# EAGLE design 150110_AriloTX_REV2_3_0_868MHZ_CORRECT_TEL (EAGLE 6.5.0)
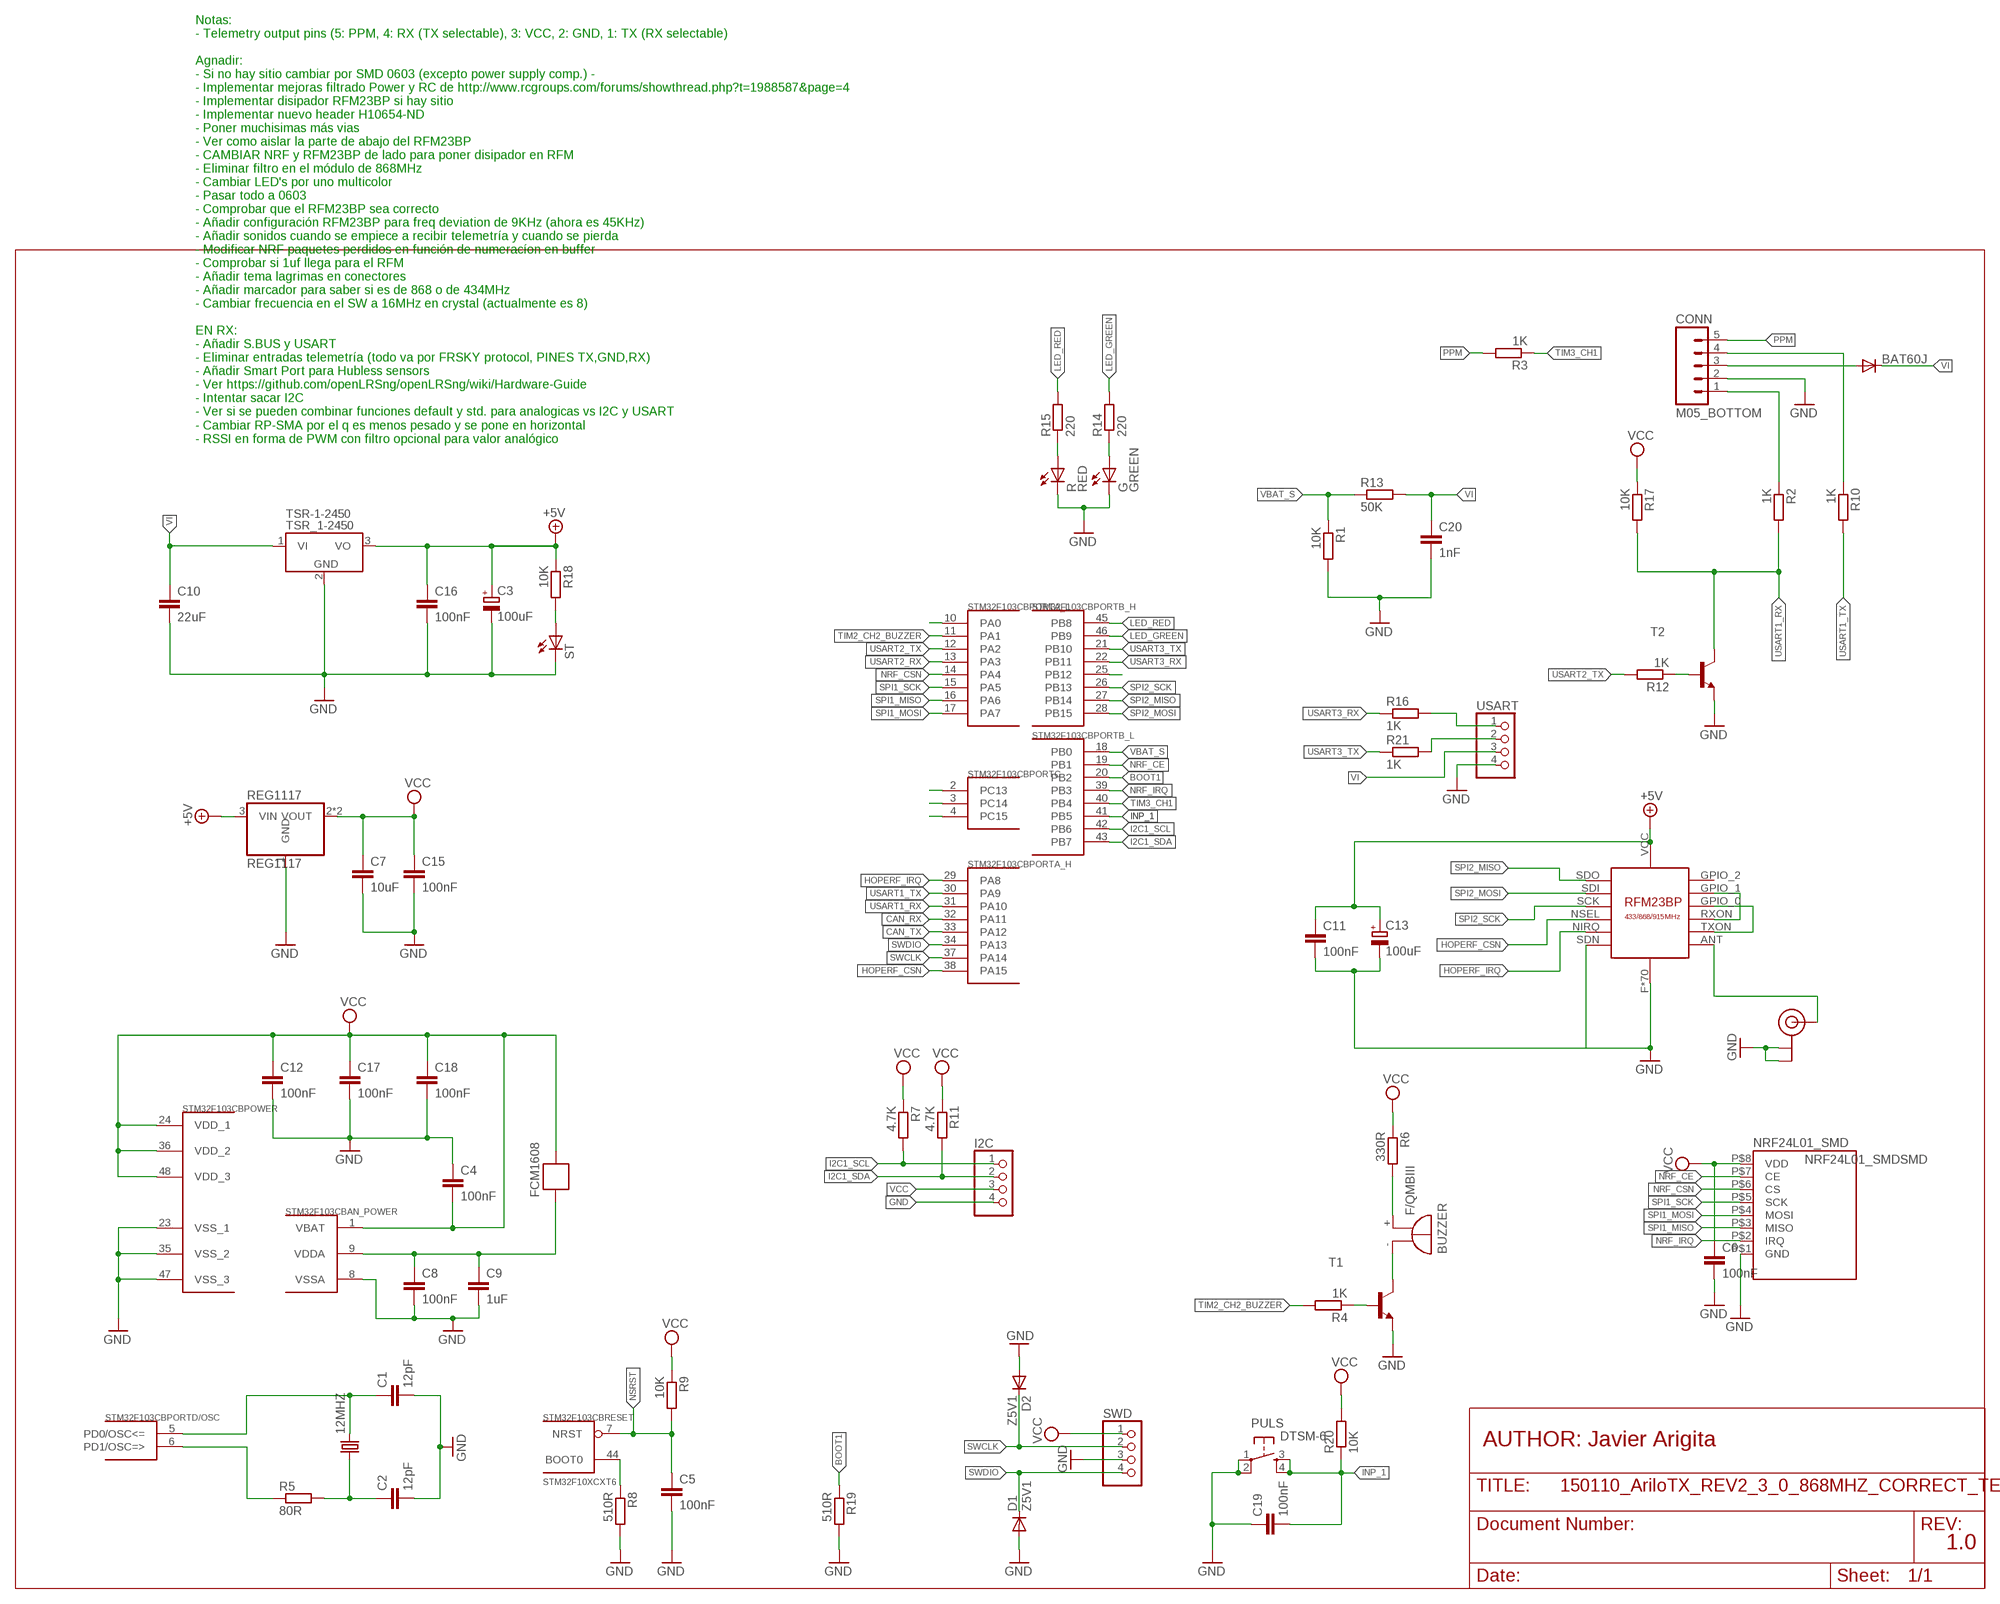
[diagram p0: schematic, sheet 1]

## Parts
12MHZ  CRYSTAL5X3  [CRYSTAL-SMD-5X3]
BAT60J  DIODE-SOD323-R  [SOD323-R]
BUZZER  F/QMBIII  [F/QMBIII]
C1  12pF  C-EUC0603  [C0603]
C2  12pF  C-EUC0603  [C0603]
C3  100uF  CPOL-EUSMCB  [SMC_B]
C4  100nF  C-EUC0603  [C0603]
C5  100nF  C-EUC0603  [C0603]
C6  100nF  C-EUC0603  [C0603]
C7  10uF  C-EUC0805  [C0805]
C8  100nF  C-EUC0603  [C0603]
C9  1uF  C-EUC0603  [C0603]
C10  22uF  C-EUC3216  [C3216]
C11  100nF  C-EUC0603  [C0603]
C12  100nF  C-EUC0603  [C0603]
C13  100uF  CPOL-EUSMCB  [SMC_B]
C15  100nF  C-EUC0603  [C0603]
C16  100nF  C-EUC0603  [C0603]
C17  100nF  C-EUC0603  [C0603]
C18  100nF  C-EUC0603  [C0603]
C19  100nF  C-EUC0603  [C0603]
C20  1nF  C-EUC0603  [C0603]
CONN  M05_BOTTOM  [M05_BOTTOM]
D1  Z5V1  DIODE-SOD323-R  [SOD323-R]
D2  Z5V1  DIODE-SOD323-R  [SOD323-R]
FCM1608  FERRITE-BEAD  [R0603]
G  GREEN  LEDCHIP-LED0603  [CHIP-LED0603]
I2C  PINHD-1X4  [1X04]
NRF24L01_SMD  NRF24L01_SMDSMD  [NRF24L01_SMD]
PULS  DTSM-6  [DTSM-6]
R  RED  LEDCHIP-LED0603  [CHIP-LED0603]
R1  10K  R-EU_R0603  [R0603]
R2  1K  R-EU_R0603  [R0603]
R3  1K  R-EU_R0603  [R0603]
R4  1K  R-EU_R0603  [R0603]
R5  80R  R-EU_R0603  [R0603]
R6  330R  R-EU_R0603  [R0603]
R7  4.7K  R-EU_R0603  [R0603]
R8  510R  R-EU_R0603  [R0603]
R9  10K  R-EU_R0603  [R0603]
R10  1K  R-EU_R0603  [R0603]
R11  4.7K  R-EU_R0603  [R0603]
R12  1K  R-EU_R0603  [R0603]
R13  50K  R-EU_R0603  [R0603]
R14  220  R-EU_R0603  [R0603]
R15  220  R-EU_R0603  [R0603]
R16  1K  R-EU_R0603  [R0603]
R17  10K  R-EU_R0603  [R0603]
R18  10K  R-EU_R0603  [R0603]
R19  510R  R-EU_R0603  [R0603]
R20  10K  R-EU_R0603  [R0603]
R21  1K  R-EU_R0603  [R0603]
REG1117  REG1117  [SOT223]
ST  LEDCHIP-LED0603  [CHIP-LED0603]
STM32F103CB  STM32F10XCXT6  [TQFP48]
SWD  PINHD-1X4  [1X04]
T1  BC848-NPN-SOT23-BEC  [SOT23-BEC]
T2  BC848-NPN-SOT23-BEC  [SOT23-BEC]
TSR-1-2450  TSR_1-2450  [TSR-1]
U$1  RFM23BP  [RFM23BP]
U.FL  U.FL  [U.FL]
USART  PINHD-1X4  [1X04]

## Nets
+5V: C3.+ C11.1 C13.+ C16.1 R18.1 REG1117.3(VIN) TSR-1-2450.3(VO) U$1.VCC
BOOT1: R19.1 STM32F103CB.20(PORTB_L:PB2)
CAN_RX: STM32F103CB.32(PORTA_H:PA11)
CAN_TX: STM32F103CB.33(PORTA_H:PA12)
GND: C1.2 C2.2 C3.- C4.1 C5.2 C6.2 C7.2 C8.2 C9.2 C10.2 C11.2 C12.2 C13.- C15.2 C16.2 C17.2 C18.2 C19.1 C20.2 CONN.2 D1.A D2.A G.C I2C.4 NRF24L01_SMD.P$1(GND) PULS.1 PULS.2 R1.2 R8.2 R19.2 R.C REG1117.1(GND) ST.C STM32F103CB.8(AN_POWER:VSSA) STM32F103CB.23(POWER:VSS_1) STM32F103CB.35(POWER:VSS_2) STM32F103CB.47(POWER:VSS_3) SWD.3 T1.E T2.E TSR-1-2450.2(GND) U$1.F1(GND) U$1.F2(GND) U$1.F3(GND) U$1.F4(GND) U$1.F5(GND) U$1.F6(GND) U$1.F7(GND) U$1.F8(GND) U$1.F9(GND) U$1.F10(GND) U$1.F11(GND) U$1.F12(GND) U$1.F13(GND) U$1.F14(GND) U$1.F15(GND) U$1.F16(GND) U$1.F17(GND) U$1.F18(GND) U$1.F19(GND) U$1.F20(GND) U$1.F21(GND) U$1.F22(GND) U$1.F23(GND) U$1.F24(GND) U$1.F25(GND) U$1.F26(GND) U$1.F27(GND) U$1.F28(GND) U$1.F29(GND) U$1.F30(GND) U$1.F31(GND) U$1.F32(GND) U$1.F33(GND) U$1.F34(GND) U$1.F35(GND) U$1.F36(GND) U$1.F37(GND) U$1.F38(GND) U$1.F39(GND) U$1.F40(GND) U$1.F41(GND) U$1.F42(GND) U$1.F43(GND) U$1.F44(GND) U$1.F45(GND) U$1.F46(GND) U$1.F47(GND) U$1.F48(GND) U$1.F49(GND) U$1.F50(GND) U$1.F51(GND) U$1.F52(GND) U$1.F53(GND) U$1.F54(GND) U$1.F55(GND) U$1.F56(GND) U$1.F57(GND) U$1.F58(GND) U$1.F59(GND) U$1.F60(GND) U$1.F61(GND) U$1.F62(GND) U$1.F63(GND) U$1.F64(GND) U$1.F65(GND) U$1.F(GND) U$1.GND1(GND) U$1.GND2(GND) U$1.GND3(GND) U$1.GND_HEAT(GND) U$1.SDN U.FL.P$1(GND) U.FL.P$2(GND) USART.4
HOPERF_CSN: STM32F103CB.38(PORTA_H:PA15) U$1.NSEL
HOPERF_IRQ: STM32F103CB.29(PORTA_H:PA8) U$1.NIRQ
I2C1_SCL: I2C.1 R7.2 STM32F103CB.42(PORTB_L:PB6)
I2C1_SDA: I2C.2 R11.2 STM32F103CB.43(PORTB_L:PB7)
INP_1: C19.2 PULS.3 PULS.4 R20.1 STM32F103CB.41(PORTB_L:PB5)
LED_GREEN: R14.2 STM32F103CB.46(PORTB_H:PB9)
LED_RED: R15.2 STM32F103CB.45(PORTB_H:PB8)
N$1: 12MHZ.3 C1.1 STM32F103CB.5(PORTD/OSC:PD0/OSC<=)
N$2: R5.1 STM32F103CB.6(PORTD/OSC:PD1/OSC=>)
N$3: 12MHZ.1 C2.1 R5.2
N$4: R8.1 STM32F103CB.44(RESET:BOOT0)
N$5: R12.1 T2.B
N$6: CONN.1 R2.1
N$7: R15.1 R.A
N$8: G.A R14.1
N$9: CONN.4 R10.1
N$10: R18.2 ST.A
N$11: U$1.ANT U.FL.P$3(SIGNAL)
N$12: R16.2 USART.1
N$13: R21.2 USART.2
N$14: BAT60J.A CONN.3
N$15: STM32F103CB.2(PORTC:PC13)
N$16: BUZZER.+(-) R6.2
N$17: C8.1 C9.1 FCM1608.2 STM32F103CB.9(AN_POWER:VDDA)
N$18: STM32F103CB.3(PORTC:PC14)
N$19: STM32F103CB.4(PORTC:PC15)
N$21: R4.1 T1.B
N$22: STM32F103CB.25(PORTB_H:PB12)
N$23: BUZZER.-(+) T1.C
N$24: STM32F103CB.10(PORTA_L:PA0)
N$25: U$1.GPIO_1 U$1.RXON
N$26: U$1.GPIO_0 U$1.TXON
NRF_CE: NRF24L01_SMD.P$7(CE) STM32F103CB.19(PORTB_L:PB1)
NRF_CSN: NRF24L01_SMD.P$6(CS) STM32F103CB.14(PORTA_L:PA4)
NRF_IRQ: NRF24L01_SMD.P$2(IRQ) STM32F103CB.39(PORTB_L:PB3)
NSRST: C5.1 R9.2 STM32F103CB.7(RESET:NRST)
PPM: CONN.5 R3.2
SPI1_MISO: NRF24L01_SMD.P$3(MISO) STM32F103CB.16(PORTA_L:PA6)
SPI1_MOSI: NRF24L01_SMD.P$4(MOSI) STM32F103CB.17(PORTA_L:PA7)
SPI1_SCK: NRF24L01_SMD.P$5(SCK) STM32F103CB.15(PORTA_L:PA5)
SPI2_MISO: STM32F103CB.27(PORTB_H:PB14) U$1.SDO
SPI2_MOSI: STM32F103CB.28(PORTB_H:PB15) U$1.SDI
SPI2_SCK: STM32F103CB.26(PORTB_H:PB13) U$1.SCK
SWCLK: D2.C STM32F103CB.37(PORTA_H:PA14) SWD.2
SWDIO: D1.C STM32F103CB.34(PORTA_H:PA13) SWD.4
TIM2_CH2_BUZZER: R4.2 STM32F103CB.11(PORTA_L:PA1)
TIM3_CH1: R3.1 STM32F103CB.40(PORTB_L:PB4)
USART1_RX: R2.2 R17.2 STM32F103CB.31(PORTA_H:PA10) T2.C
USART1_TX: R10.2 STM32F103CB.30(PORTA_H:PA9)
USART2_RX: STM32F103CB.13(PORTA_L:PA3)
USART2_TX: R12.2 STM32F103CB.12(PORTA_L:PA2)
USART3_RX: R16.1 STM32F103CB.22(PORTB_H:PB11)
USART3_TX: R21.1 STM32F103CB.21(PORTB_H:PB10)
VBAT_S: R1.1 R13.1 STM32F103CB.18(PORTB_L:PB0)
VCC: C4.2 C6.1 C7.1 C12.1 C15.1 C17.1 C18.1 FCM1608.1 I2C.3 NRF24L01_SMD.P$8(VDD) R6.1 R7.1 R9.1 R11.1 R17.1 R20.2 REG1117.2(VOUT) REG1117.4(VOUT) STM32F103CB.1(AN_POWER:VBAT) STM32F103CB.24(POWER:VDD_1) STM32F103CB.36(POWER:VDD_2) STM32F103CB.48(POWER:VDD_3) SWD.1
VI: BAT60J.C C10.1 C20.1 R13.2 TSR-1-2450.1(VI) USART.3
Unconnected: U$1.GPIO_2

## Notes on the sheet
- Notas: 
  - Telemetry output pins (5: PPM, 4: RX (TX selectable), 3: VCC, 2: GND, 1: TX (RX selectable)
  
  Agnadir: 
  - Si no hay sitio cambiar por SMD 0603 (excepto power supply comp.) - 
  - Implementar mejoras filtrado Power y RC de http://www.rcgroups.com/forums/showthread.php?t=1988587&page=4 
  - Implementar disipador RFM23BP si hay sitio
  - Implementar nuevo header H10654-ND
  - Poner muchisimas más vias
  - Ver como aislar la parte de abajo del RFM23BP
  - CAMBIAR NRF y RFM23BP de lado para poner disipador en RFM
  - Eliminar filtro en el módulo de 868MHz
  - Cambiar LED's por uno multicolor
  - Pasar todo a 0603
  - Comprobar que el RFM23BP sea correcto
  - Añadir configuración RFM23BP para freq deviation de 9KHz (ahora es 45KHz)
  - Añadir sonidos cuando se empiece a recibir telemetría y cuando se pierda
  - Modificar NRF paquetes perdidos en función de numeracíon en buffer
  - Comprobar si 1uf llega para el RFM
  - Añadir tema lagrimas en conectores
  - Añadir marcador para saber si es de 868 o de 434MHz
  - Cambiar frecuencia en el SW a 16MHz en crystal (actualmente es 8)
  
  EN RX:
  - Añadir S.BUS y USART
  - Eliminar entradas telemetría (todo va por FRSKY protocol, PINES TX,GND,RX)
  - Añadir Smart Port para Hubless sensors
  - Ver https://github.com/openLRSng/openLRSng/wiki/Hardware-Guide
  - Intentar sacar I2C
  - Ver si se pueden combinar funciones default y std. para analogicas vs I2C y USART
  - Cambiar RP-SMA por el q es menos pesado y se pone en horizontal
  - RSSI en forma de PWM con filtro opcional para valor analógico
- AUTHOR: Javier Arigita
- 1.0

## Library data of the parts
12MHZ = SparkFun-FreqCtrl:CRYSTAL: Various standard crystals. Proven footprints. Spark Fun Electronics SKU : COM-00534
BAT60J D1 D2 = diode:DIODE-: DIODE
BUZZER = buzzer:F/QMBIII: BUZZER Source: Buerklin; OC_FARNELL: unknown; OC_NEWARK: unknown
C1 C2 C4-C9 C11 C12 C15-C20 = rcl:C-EU: CAPACITOR, European symbol
C3 C13 = rcl:CPOL-EU: POLARIZED CAPACITOR, European symbol
C10 = resistor:C-EU: CAPACITOR, European symbol
CONN = RFM23BP_new:M05_BOTTOM
FCM1608 = BaseApp:FERRITE-BEAD
G R ST = led:LED: LED OSRAM: - CHIPLED LG R971, LG N971, LY N971, LG Q971, LY Q971, LO R971, LY R971 LH N974, LH R974 LS Q976, LO Q976, LY Q976 LO Q996 - Hyper CHIPLED LW Q18S LB Q993, LB Q99A, LB R99A - SideLED LS A670, LO A670, LY A670, LG A670, LP A670 LB A673, LV A673, LT A673, LW A673 LH A674 LY A675 LS A676, LA A676, LO A676, LY A676, LW A676 LS A679, LY A679, LG A679 - Hyper Micro SIDELED® LS Y876, LA Y876, LO Y876, LY Y876 LT Y87S - SmartLED LW L88C, LW L88S LB L89C, LB L89S, LG L890 LS L89K, LO L89K, LY L89K LS L896, LA L896, LO L896, LY L896 - TOPLED LS T670, LO T670, LY T670, LG T670, LP T670 LSG T670, LSP T670, LSY T670, LOP T670, LYG T670 LG T671, LOG T671, LSG T671 LB T673, LV T673, LT T673, LW T673 LH T674 LS T676, LA T676, LO T676, LY T676, LB T676, LH T676, LSB T676, LW T676 LB T67C, LV T67C, LT T67C, LS T67K, LO T67K, LY T67K, LW E67C LS E67B, LA E67B, LO E67B, LY E67B, LB E67C, LV E67C, LT E67C LW T67C LS T679, LY T679, LG T679 LS T770, LO T770, LY T770, LG T770, LP T770 LB T773, LV T773, LT T773, LW T773 LH T774 LS E675, LA E675, LY E675, LS T675 LS T776, LA T776, LO T776, LY T776, LB T776 LHGB T686 LT T68C, LB T68C - Hyper Mini TOPLED® LB M676 - Mini TOPLED Santana® LG M470 LS M47K, LO M47K, LY M47K Source: http://www.osram.convergy.de LUXEON: - LUMILED® LXK2-PW12-R00, LXK2-PW12-S00, LXK2-PW14-U00, LXK2-PW14-V00 LXK2-PM12-R00, LXK2-PM12-S00, LXK2-PM14-U00 LXK2-PE12-Q00, LXK2-PE12-R00, LXK2-PE12-S00, LXK2-PE14-T00, LXK2-PE14-U00 LXK2-PB12-K00, LXK2-PB12-L00, LXK2-PB12-M00, LXK2-PB14-N00, LXK2-PB14-P00, LXK2-PB14-Q00 LXK2-PR12-L00, LXK2-PR12-M00, LXK2-PR14-Q00, LXK2-PR14-R00 LXK2-PD12-Q00, LXK2-PD12-R00, LXK2-PD12-S00 LXK2-PH12-R00, LXK2-PH12-S00 LXK2-PL12-P00, LXK2-PL12-Q00, LXK2-PL12-R00 Source: www.luxeon.com KINGBRIGHT: KA-3528ASYC Source: www.kingbright.com
I2C SWD USART = pinhead:PINHD-1X4: PIN HEADER
NRF24L01_SMD = NRF24L01+:NRF24L01_SMD
PULS = switch-tact:DTSM-6
R1-R21 = rcl:R-EU_: RESISTOR, European symbol
REG1117 = CEDT:REG1117: 800mA and 1A Low Dropout (LDO) Positive Regulator 1.8V, 2.5V, 2.85V, 3.3V, 5V, and Adj
STM32F103CB = stm32:STM32F10XCXT6: ST STM32F101/103 48pin LQFP
T1 T2 = transistor:*-NPN-: NPN Transistror BF959 corrected 2008.03.06
TSR-1-2450 = _hhn_traco_tsr-1:TSR_1-*: TRACO TSR-1 Series Point-of-Load DC/DC-Converters Vi max. 36 V; Vo = (1.2 .. 15)V ±2%; Io = 0 .. 1 A SIP-Package (drop-in replacement for 78xx linear voltage regulators in TO220-package, vertically assembled) Source: www.tracopower.com Technologies: TSR 1- Vi (V) Vo (V) ±2% Io = 0 .. 1 A 24_ ( generic ) 2412 4.6 .. 36 1.2 2415 4.6 .. 36 1.5 2418 4.6 .. 36 1.8 2425 4.6 .. 36 2.5 2433 4.75.. 36 3.3 2450 6.5 .. 36 5.0 2465 9.0 .. 36 6.5 2490 12 .. 36 9.0 24120 15 .. 36 12 24150 18 .. 36 15 Author: Dipl.-Ing. FH Rainer Bayer HHN Hochschule Heilbronn, rainer.bayer@hs-heilbronn.de Ingenieurbüro ing-rb, mail@ing-rb.de
U$1 = RFM23BP:RFM23BP: HopeRF RFM23BP Library by: http://projects.weber-itam.de
U.FL = SparkFun-Connectors:U.FL: SMD antenna connector- WRL-09144

## Board
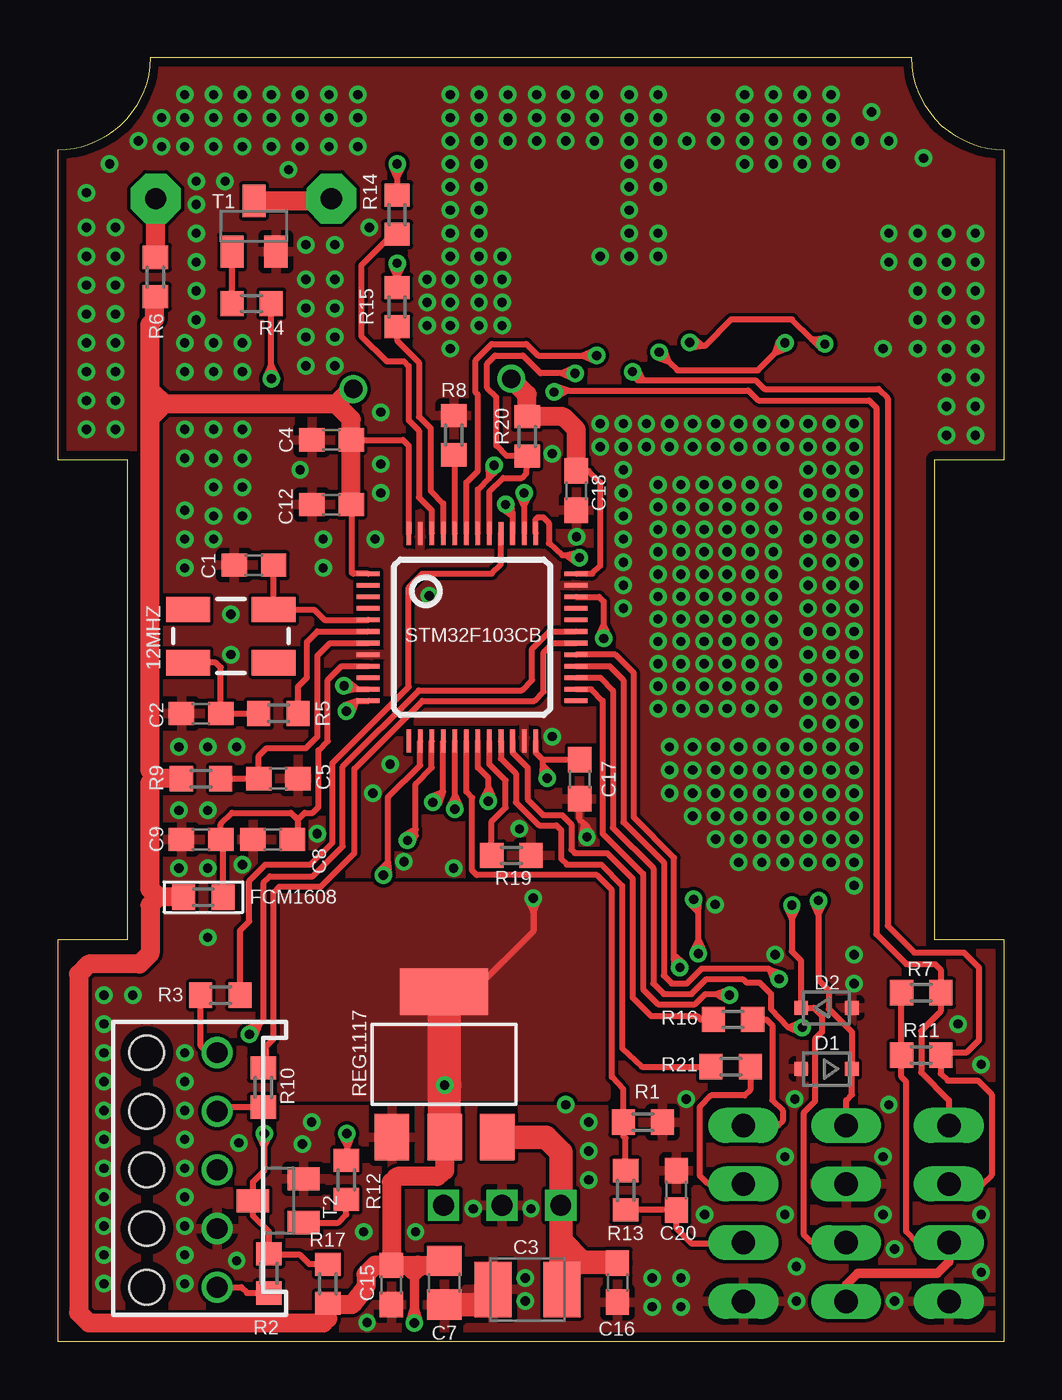
[diagram p1: board, top side]
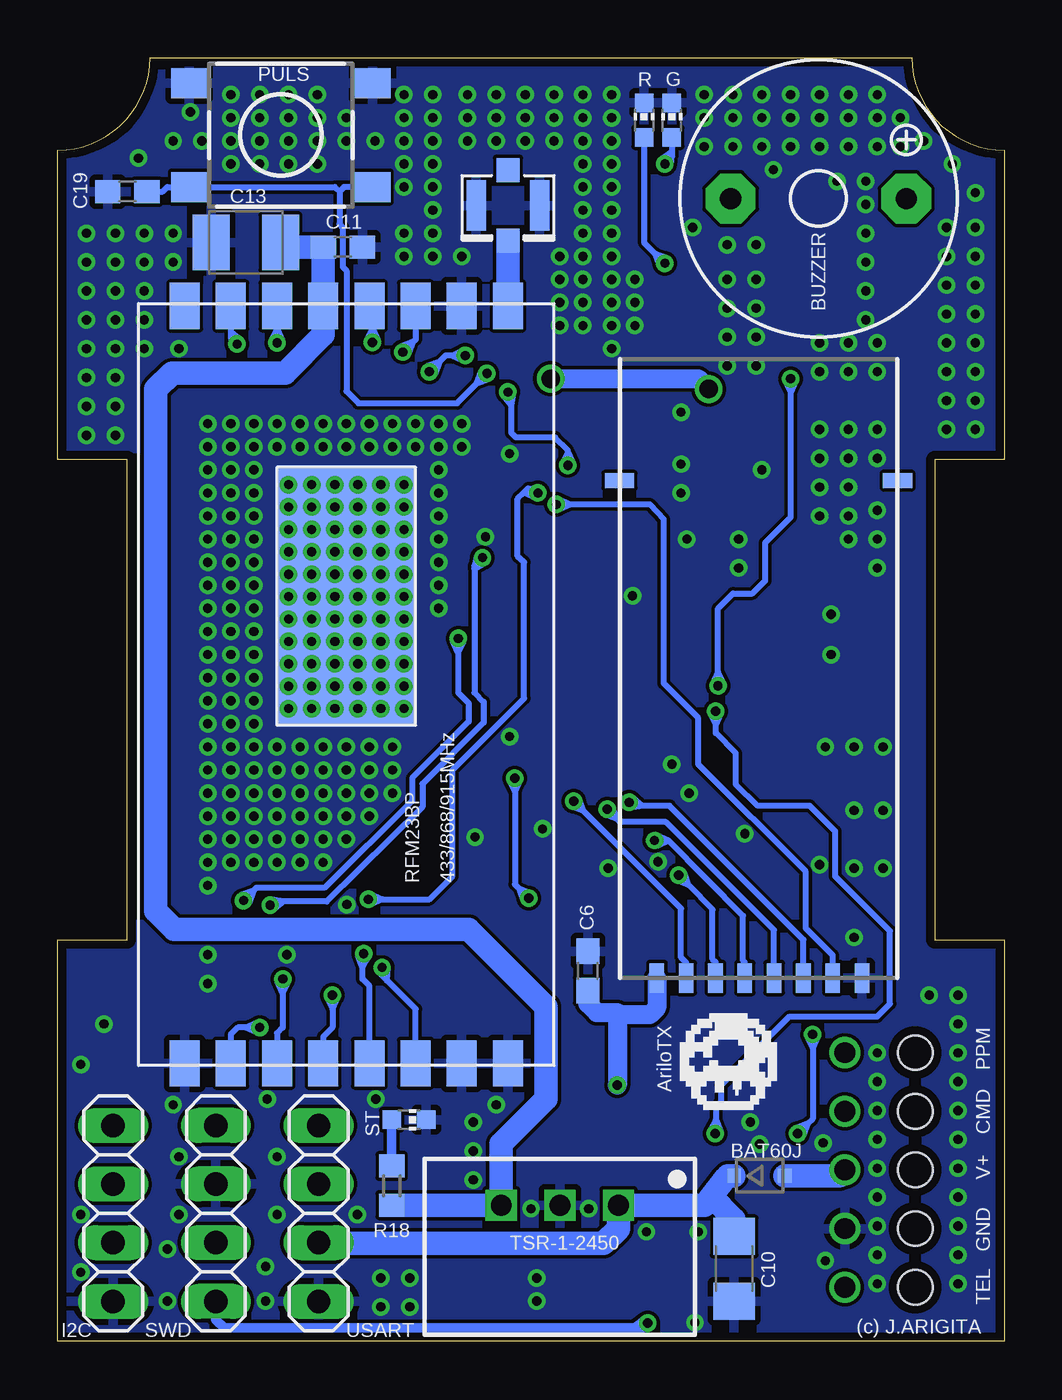
[diagram p2: board, bottom side, seen from below]

Size 41 x 55.6 mm. Coordinates in mm from the lower left corner, seen from the top.
Outline: 0,0 41,0 41,17.4 38,17.4 38,38.2 41,38.2 41,51.6 arc-90 37,55.6 4,55.6 arc-90 0,51.6 0,38.2 3,38.2 3,17.4 0,17.4 0,0
Copper layers (1*16): Top 0.0356mm / dielectric 1.5011mm / Bottom 0.0356mm
Design rules "LaenPCBOrder": minimum track width 6mil, minimum drill 13mil, track to track 6mil, track to pad 6mil, pad to pad 6mil, via to via 6mil, smd to smd 6mil, copper to edge 15mil, drill to drill 6mil, minimum pad ring 7mil, minimum via ring 7mil, stop-mask expansion 4mil, vias tented up to drill 0mil, thermal gap 10mil

### Footprints (pad centres in the part's own frame; a part is rotated, then mirrored left to right if it is on the bottom)
CRYSTAL-SMD-5X3 = smd 1.9 x 1.1: 1 -1.85,-1.15; 2 1.85,-1.15; 3 1.85,1.15; 4 -1.85,1.15
SOD323-R = smd 0.6 x 0.6: A 1.1,0; C -1.1,0
F/QMBIII = drill 0.914 pad 2.159 octagon: + 3.8,0; - -3.8,0
C0603 = smd 1.1 x 1: 1 -0.85,0; 2 0.85,0
SMC_B = smd 1.6 x 2.4: + -1.5,0; - 1.5,0
C0805 = smd 1.3 x 1.5: 1 -0.95,0; 2 0.95,0
C3216 = smd 1.6 x 1.8: 1 -1.4,0; 2 1.4,0
M05_BOTTOM = drill 0.9: 1 -5.1,-1.5; 2 -2.56,-1.5; 3 -0.02,-1.5; 4 2.52,-1.5; 5 5.06,-1.5 | hole 1.5: -5.1,1.54; -2.56,1.54; -0.02,1.54; 2.52,1.54; 5.06,1.54
R0603 = smd 1 x 1.1: 1 -0.85,0; 2 0.85,0
CHIP-LED0603 = smd 0.8 x 0.8: A 0,-0.75; C 0,0.75
1X04 = drill 1.016 long: 1 -3.81,0; 2 -1.27,0; 3 1.27,0; 4 3.81,0
NRF24L01_SMD = smd 1.27 x 0.635: P$1 26.807,10.492; P$2 26.807,9.222; P$3 26.807,7.952; P$4 26.807,6.682; P$5 26.807,5.412; P$6 26.807,4.142; P$7 26.807,2.872; P$8 26.807,1.602 | smd 0.635 x 1.27: P$11 5.267,-0.018; P$13 5.267,12.032
DTSM-6 = smd 1.55 x 1.3: 1 -3.975,2.25; 2 3.975,2.25; 3 -3.975,-2.25; 4 3.975,-2.25
SOT223 = smd 1.499 x 2.007: 1 -2.261,-3.15; 2 0.025,-3.15; 3 2.311,-3.15 | smd 3.81 x 2.007: 4 0,3.15
TQFP48 = smd 0.2 x 1: 1 -2.75,-4.5; 2 -2.25,-4.5; 3 -1.75,-4.5; 4 -1.25,-4.5; 5 -0.75,-4.5; 6 -0.25,-4.5; 7 0.25,-4.5; 8 0.75,-4.5; 9 1.25,-4.5; 10 1.75,-4.5; 11 2.25,-4.5; 12 2.75,-4.5; 25 2.75,4.5; 26 2.25,4.5; 27 1.75,4.5; 28 1.25,4.5; 29 0.75,4.5; 30 0.25,4.5; 31 -0.25,4.5; 32 -0.75,4.5; 33 -1.25,4.5; 34 -1.75,4.5; 35 -2.25,4.5; 36 -2.75,4.5 | smd 1 x 0.2: 13 4.5,-2.75; 14 4.5,-2.25; 15 4.5,-1.75; 16 4.5,-1.25; 17 4.5,-0.75; 18 4.5,-0.25; 19 4.5,0.25; 20 4.5,0.75; 21 4.5,1.25; 22 4.5,1.75; 23 4.5,2.25; 24 4.5,2.75; 37 -4.5,2.75; 38 -4.5,2.25; 39 -4.5,1.75; 40 -4.5,1.25; 41 -4.5,0.75; 42 -4.5,0.25; 43 -4.5,-0.25; 44 -4.5,-0.75; 45 -4.5,-1.25; 46 -4.5,-1.75; 47 -4.5,-2.25; 48 -4.5,-2.75
SOT23-BEC = smd 1 x 1.4: B -0.95,-1.1; C 0,1.1; E 0.95,-1.1
TSR-1 = drill 0.9 square: 1 -2.54,0; 2 0,0; 3 2.54,0
RFM23BP = smd 2 x 1.3: ANT 16.9,-7.5; GND1 -15.9,6.5; GND2 -15.9,-7.5; GND3 16.9,-5.5; GPIO_0 16.9,2.5; GPIO_1 16.9,4.5; GPIO_2 16.9,6.5; NIRQ -15.9,-3.5; NSEL -15.9,-1.5; RXON 16.9,-1.5; SCK -15.9,0.5; SDI -15.9,2.5; SDN -15.9,-5.5; SDO -15.9,4.5; TXON 16.9,-3.5; VCC 16.9,0.5 | drill 0.4: F -0.54,2; F1 -0.54,1; F2 -0.54,0; F3 -0.54,-1; F4 -0.54,-2; F5 -0.54,-3; F6 0.43,2; F7 0.43,1; F8 0.43,0; F9 0.43,-1; F10 0.43,-2; F11 0.43,-3; F12 1.4,2; F13 1.4,1; F14 1.4,0; F15 1.4,-1; F16 1.4,-2; F17 1.4,-3; F18 2.37,2; F19 2.37,1; F20 2.37,0; F21 2.37,-1; F22 2.37,-2; F23 2.37,-3; F24 3.34,2; F25 3.34,1; F26 3.34,0; F27 3.34,-1; F28 3.34,-2; F29 3.34,-3; F30 4.31,2; F31 4.31,1; F32 4.31,0; F33 4.31,-1; F34 4.31,-2; F35 4.31,-3; F36 5.28,2; F37 5.28,1; F38 5.28,0; F39 5.28,-1; F40 5.28,-2; F41 5.28,-3; F42 6.25,2; F43 6.25,1; F44 6.25,0; F45 6.25,-1; F46 6.25,-2; F47 6.25,-3; F48 7.22,2; F49 7.22,1; F50 7.22,0; F51 7.22,-1; F52 7.22,-2; F53 7.22,-3; F54 8.19,2; F55 8.19,1; F56 8.19,0; F57 8.19,-1; F58 8.19,-2; F59 8.19,-3; F60 9.16,2; F61 9.16,1; F62 9.16,0; F63 9.16,-1; F64 9.16,-2; F65 9.16,-3 | smd 11.18 x 6: GND_HEAT 4.33,-0.5
U.FL = smd 2.2 x 0.85: P$1 0,1.375; P$2 0,-1.375 | smd 1.05 x 1: P$3 1.525,0; P$4 -1.525,0

### Placement (x,y rotation side)
12MHZ  7.5,30.55 0 top
BAT60J  10.6,7.18 0 bottom
BUZZER  8.05,49.5 0 bottom
C1  8.5,33.62 180 top
C2  6.21,27.2 180 top
C3  20.35,2.25 180 top
C4  11.86,39.05 0 top
C5  9.56,24.38 0 top
C6  18.04,16.05 90 bottom
C7  16.75,2.55 270 top
C8  9.31,21.75 180 top
C9  6.21,21.75 180 top
C10  11.7,3.15 270 bottom
C11  28.65,47.4 0 bottom
C12  11.86,36.25 180 top
C13  32.85,47.6 180 bottom
C15  14.45,2.45 270 top
C16  24.25,2.55 270 top
C17  22.61,24.35 270 top
C18  22.46,36.85 270 top
C19  37.98,49.8 0 bottom
C20  26.8,6.55 90 top
CONN  5.4,7.45 90 top
D1  33.3,11.8 180 top
D2  33.3,14.45 0 top
FCM1608  6.31,19.25 0 top
G  14.4,52.9 0 bottom
I2C  38.6,5.55 270 bottom
NRF24L01_SMD  16.65,42.55 270 bottom
PULS  31.34,52.25 0 bottom
R  15.6,52.9 0 bottom
R1  25.35,9.5 0 top
R2  9.15,2.95 90 top
R3  7.05,15 180 top
R4  8.4,44.95 0 top
R5  9.56,27.2 180 top
R6  4.24,46.1 90 top
R7  37.4,15.1 0 top
R8  17.16,39.25 90 top
R9  6.21,24.38 0 top
R10  8.9,11 90 top
R11  37.4,12.4 0 top
R12  12.5,7 90 top
R13  24.6,6.55 270 top
R14  14.7,48.8 270 top
R15  14.7,44.8 270 top
R16  29.25,13.95 0 top
R17  11.7,2.5 90 top
R18  26.54,6.75 90 bottom
R19  19.65,21.05 0 top
R20  20.34,39.2 90 top
R21  29.15,11.9 0 top
REG1117  16.73,12 0 top
ST  25.79,9.6 270 bottom
STM32F103CB  17.95,30.5 270 top
SWD  34.15,5.55 90 bottom
T1  8.5,48.3 0 top
T2  9.55,6.1 90 top
TSR-1-2450  19.25,5.9 180 bottom
U$1  29,27.95 90 bottom
U.FL  21.5,49.2 270 bottom
USART  29.7,5.55 270 bottom

### Tracks (layer width: path | path; a pad name or v marks a point on that pad's centre or on a via)
+5V
  Top 1.016: 21.79,6.06 TSR-1-2450.3 | TSR-1-2450.3 21.8,2.4 | 21.8,2.4 21.8,4.35 22.71,3.44 24.25,3.44 C16.1 | C3.+ 21.8,2.35 21.8,2.4 | REG1117.3 21.15,8.85 21.8,8.2 TSR-1-2450.3
  Bottom 1.016: R18.1 TSR-1-2450.3 21.8,8.55 19.85,10.5 19.85,14.5 23.2,17.85 35.95,17.85 36.75,18.65 36.75,41.25 36.05,41.95 31.15,41.95 29.5,43.6 U$1.VCC C11.1 31,47.4 C13.+
BOOT1
  Top 0.254: R19.1 18.8,22.52 19.4,23.12 19.4,24.3 18.7,25 STM32F103CB.20
GND  (via drill 0.4)
  Top 0.254: v22.93,21.85 22.93,22.3 22.79,22.43 | 22.79,22.43 22.61,22.61 C17.2 | 22.79,22.43 22.68,21.9 v22.93,21.85 | 22.79,22.43 23.12,22 v22.93,21.85
  Top 1.016: C3.- 18.2,1.6 C7.2
  other vias: 13.75,34.75 16.1,32.3 19.5,54 18.25,54 18.25,53 18.25,52 18.25,51 13,54 11.75,54 10.5,54 9.25,54 8,54 6.75,54 5.5,54 4.5,53 3.5,52 2.25,51 1.25,49.75 1.25,48.25 1.25,47 1.25,45.75 1.25,44.5 1.25,43.25 1.25,42 1.25,40.75 1.25,39.5 2.5,39.5 2.5,40.75 2.5,42 2.5,43.25 2.5,44.5 2.5,45.75 2.5,47 2.5,48.25 4.5,51.75 5.5,53 5.5,51.75 6.75,53 6.75,51.75 8,53 8,51.75 9.25,53 9.25,51.75 10.5,53 10.5,51.75 11.75,53 11.75,51.75 13,53 13,51.75 6,48 6,49.25 6,50.25 7.25,50.25 10,50.75 6,46.75 6,45.5 6,44.25 5.5,43.25 5.5,42 6.75,43.25 6.75,42 8,43.25 8,42 5.5,39.5 5.5,38.25 5.5,36 5.5,34.75 5.5,33.5 6.75,39.5 6.75,38.25 8,39.5 8,38.25 6.75,37 6.75,35.75 6.75,34.75 8,37 8,35.75 13.5,48.25 12,47.5 12,46 12,44.75 12,43.5 12,42.25 10.75,42.25 10.75,43.5 10.75,44.75 10.75,46 10.75,47.5 14,40.25 14,38 14,36.75 10.5,37.75 11.5,33.5 11.5,34.75 7.5,31.5 7.5,29.75 5.25,25.75 6.5,25.75 7.75,25.75 5.25,23 6.5,23 5.25,20.5 6.5,20.5 3.25,15 2,15 2,13.75 2,12.5 2,11.25 2,10 2,8.75 2,7.5 2,6.25 2,5 2,3.75 2,2.5 5.5,2.5 5.5,3.75 5.5,5 5.5,6.25 5.5,7.5 5.5,8.75 5.5,10 5.5,11.25 5.5,12.5 13.65,23.75 14.4,25 17.15,20.5 11.24,21.99 11,9.5 23,9.5 23,8.25 23,7 25.75,2.75 25.75,1.5 27,1.5 27,2.75 32,3.25 32,1.75 36.25,1.75 17,54 17,53 17,52 17,51 17,50 18.25,50 17,49 17,48 18.25,49 17,47 18.25,47 18.25,46 17,46 17,45 18.25,45 18.25,44 17,44 16,45 16,46 17,43 19.25,45 19.25,44 22,54 23.25,54 24.75,53 24.75,52 24.75,51 24.75,50 24.75,49 26,48 24.75,48 24.75,47 26,47 26,50 26,51 26,52 26,53 27.25,52 28.5,52 29.75,52 31,52 32.25,52 33.5,52 34.75,52 36,52 29.75,53 29.75,54 28.5,53 31,53 31,54 32.25,53 32.25,54 33.5,53 33.5,54 29.75,51 31,51 32.25,51 33.5,51 36,48 37.25,48 38.5,48 37.5,51.25 35.25,53.25 36,46.75 37.25,46.75 38.5,46.75 39.75,46.75 39.75,48 39.75,45.5 38.5,45.5 37.25,45.5 37.25,44.25 38.5,44.25 39.75,44.25 39.75,43 38.5,43 37.25,43 35.75,43 39.75,41.75 38.5,41.75 38.5,40.5 39.75,40.5 39.75,39.25 38.5,39.25 23.5,39.75 24.5,39.75 25.5,39.75 26.5,39.75 27.5,39.75 28.5,39.75 29.5,39.75 30.5,39.75 31.5,39.75 32.5,39.75 33.5,39.75 34.5,39.75 34.5,38.75 33.5,38.75 32.5,38.75 31.5,38.75 30.5,38.75 29.5,38.75 28.5,38.75 27.5,38.75 26.5,38.75 25.5,38.75 24.5,38.75 23.5,38.75 24.5,37.75 24.5,36.75 24.5,35.75 24.5,34.75 24.5,33.75 24.5,32.75 24.5,31.75 32.5,37.75 33.5,37.75 34.5,37.75 34.5,36.75 33.5,36.75 32.5,36.75 32.5,35.75 33.5,35.75 34.5,35.75 34.5,34.75 33.5,34.75 32.5,34.75 32.5,33.75 33.5,33.75 34.5,33.75 34.5,32.75 33.5,32.75 32.5,32.75 32.5,31.75 33.5,31.75 34.5,31.75 34.5,30.75 33.5,30.75 32.5,30.75 32.5,29.75 33.5,29.75 34.5,29.75 34.5,28.75 33.5,28.75 32.5,28.75 32.5,27.75 33.5,27.75 34.5,27.75 34.5,26.75 33.5,26.75 32.5,26.75 34.5,25.75 33.5,25.75 32.5,25.75 31.5,25.75 30.5,25.75 29.5,25.75 28.5,25.75 27.5,25.75 26.5,25.75 34.5,24.75 33.5,24.75 32.5,24.75 31.5,24.75 30.5,24.75 29.5,24.75 28.5,24.75 27.5,24.75 26.5,24.75 26.5,23.75 27.5,23.75 28.5,23.75 29.5,23.75 30.5,23.75 31.5,23.75 32.5,23.75 33.5,23.75 34.5,23.75 34.5,22.75 33.5,22.75 32.5,22.75 31.5,22.75 30.5,22.75 29.5,22.75 28.5,22.75 27.5,22.75 28.5,21.75 29.5,21.75 30.5,21.75 31.5,21.75 32.5,21.75 33.5,21.75 34.5,21.75 34.5,20.75 33.5,20.75 32.5,20.75 31.5,20.75 30.5,20.75 29.5,20.75 34.5,19.75 34.5,16.75 34.5,15.5 28.48,18.93 31.07,16.75 28.02,5.5 27.23,10.5 36.25,4 31.5,5.5 31.5,8 35.75,8 36,10.25 39,13.75 40,12 40,5.5 40,3 35.75,5.5 20.25,1.75 20.25,2.75 20.5,5.75 18,5.75 15.5,4.75 22,10.25 7.75,3.5 7.85,8.6 13.4,0.82 13.25,4.75 20,22.2 21.43,26.2 15,20.77 21.43,38.45 22.48,34.85 31.93,10.5 6.5,17.5 8,20.65 16,44 18.25,48 20.75,54 24.75,54 26,54 23.25,53 22,53 20.75,53 19.5,53 19.5,52 20.75,52 22,52 23.25,52 23.5,47 19.25,47 19.25,46 10.6,8.55
  pour Top (rank 2): 40.75,17.15 37.75,17.15 37.75,38.45 40.75,38.45 40.75,51.1 arc-90 36.5,55.35 4.5,55.35 arc-90 0.25,51.1 0.25,38.45 3.25,38.45 3.25,17.15 0.25,17.15 0.25,0.25 40.75,0.25
  pour Bottom (rank 2): 40.75,17.15 37.75,17.15 37.75,38.45 40.75,38.45 40.75,51.1 arc-90 36.5,55.35 4.5,55.35 arc-90 0.25,51.1 0.25,38.45 3.25,38.45 3.25,17.15 0.25,17.15 0.25,0.25 40.75,0.25
HOPERF_CSN  (via drill 0.4)
  Top 0.254: v27.75,16.8 27.75,17.4 | 27.75,17.4 27.75,18.58 | 27.75,18.58 27.75,18.95 v27.55,19.15 | v20.2,36.75 20.2,36.15 | 20.2,36.15 STM32F103CB.38 | 27.75,17.4 | 27.75,17.4 27.52,16.91 | v27.75,16.8 27.52,16.91 | 27.75,17.4 | 27.75,17.4 27.98,16.91 | v27.75,16.8 27.98,16.91 | 27.75,17.4 27.52,16.91 | 27.52,16.91 | v27.75,16.8 27.52,16.91 | 27.75,17.4 27.98,16.91 | v27.75,16.8 27.98,16.91 | 27.75,17.4 27.52,16.91 | v27.75,16.8 27.52,16.91 | 27.75,17.4 27.98,16.91 | v27.75,16.8 27.98,16.91 | 27.75,18.58 27.8,19.13 v27.55,19.15 | 27.75,18.58 27.37,18.98 v27.55,19.15 | 20.2,36.15 20.43,36.65 | v20.2,36.75 20.43,36.65 | 20.2,36.15 19.97,36.65 | v20.2,36.75 19.97,36.65 | 20.2,36.15 20.43,36.65 | 20.43,36.65 | v20.2,36.75 20.43,36.65 | 20.2,36.15 19.97,36.65 | v20.2,36.75 19.97,36.65 | 20.2,36.15 20.43,36.65 | v20.2,36.75 20.43,36.65 | 20.2,36.15 19.97,36.65 | v20.2,36.75 19.97,36.65
  Bottom 0.254: U$1.NSEL 27.5,15.4 27.8,15.7 27.8,16.2 | 27.8,16.2 27.8,16.75 v27.75,16.8 | v27.55,19.15 26.95,19.15 | 26.95,19.15 24.9,19.15 23.9,20.15 23.9,24.75 20.8,27.85 20.8,33.75 21.07,34 21.07,36.5 20.8,36.78 | 20.8,36.78 20.62,36.95 20.4,36.95 v20.2,36.75 | 27.8,16.2 27.99,16.71 v27.75,16.8 | 27.8,16.2 27.53,16.68 v27.75,16.8 | 26.95,19.15 | 26.95,19.15 27.45,18.92 | v27.55,19.15 27.45,18.92 | 26.95,19.15 | 26.95,19.15 27.45,19.38 | v27.55,19.15 27.45,19.38 | 26.95,19.15 27.45,18.92 | 27.45,18.92 | v27.55,19.15 27.45,18.92 | 26.95,19.15 27.45,19.38 | v27.55,19.15 27.45,19.38 | 26.95,19.15 27.45,18.92 | v27.55,19.15 27.45,18.92 | 26.95,19.15 27.45,19.38 | v27.55,19.15 27.45,19.38 | 20.8,36.78 20.3,36.98 v20.2,36.75 | 20.8,36.78 20.31,36.53 v20.2,36.75
HOPERF_IRQ  (via drill 0.4)
  Top 0.254: v26.95,16.2 26.7,16.5 26.7,16.75 | 26.7,16.75 26.7,20.95 24.95,22.7 24.95,28.95 24.15,29.75 STM32F103CB.29 | 26.7,16.75 26.7,16.2 v26.95,16.2 | 26.7,16.75 27.11,16.39 v26.95,16.2
  Bottom 0.254: U$1.NIRQ 25.5,14.4 26.74,15.64 | 26.74,15.64 26.95,15.85 v26.95,16.2 | 26.74,15.64 27.13,16.02 v26.95,16.2 | 26.74,15.64 26.7,16.18 v26.95,16.2
I2C1_SCL  (via drill 0.4)
  Top 0.254: STM32F103CB.42 18.2,36.9 18.69,37.39 | 18.69,37.39 18.9,37.6 v18.9,37.95 | v21.5,41.12 21.58,41.19 22.1,41.19 | 22.1,41.19 29.91,41.19 30.35,40.75 35.15,40.75 35.45,40.45 35.45,17.65 36.75,16.35 38,16.35 38.25,16.1 R7.2 38.25,14.3 37.4,13.45 37.4,11.65 38.6,10.45 I2C.1 | 18.69,37.39 19.08,37.77 v18.9,37.95 | 18.69,37.39 18.65,37.93 v18.9,37.95 | 22.1,41.19 21.58,41.36 v21.5,41.12 | 22.1,41.19 21.63,40.91 v21.5,41.12
  Bottom 0.254: v18.9,37.95 18.9,38.55 | 18.9,38.55 18.9,38.6 19.45,39.15 21.15,39.15 21.35,39.35 21.35,40.54 | 21.35,40.54 21.35,40.92 v21.5,41.12 | 18.9,38.55 | 18.9,38.55 18.67,38.05 | v18.9,37.95 18.67,38.05 | 18.9,38.55 | 18.9,38.55 19.13,38.05 | v18.9,37.95 19.13,38.05 | 18.9,38.55 18.67,38.05 | 18.67,38.05 | v18.9,37.95 18.67,38.05 | 18.9,38.55 19.13,38.05 | v18.9,37.95 19.13,38.05 | 18.9,38.55 18.67,38.05 | v18.9,37.95 18.67,38.05 | 18.9,38.55 19.13,38.05 | v18.9,37.95 19.13,38.05 | 21.35,40.54 21.69,40.96 v21.5,41.12 | 21.35,40.54 21.25,41.08 v21.5,41.12
I2C1_SDA  (via drill 0.4)
  Top 0.254: STM32F103CB.43 17.7,37.2 18.2,37.7 18.2,41 18.1,41.1 18.1,42.5 18.8,43.2 20.3,43.2 20.8,42.7 22.75,42.7 | 22.75,42.7 v23.35,42.7 | v24.9,42 24.9,41.86 25.13,41.63 25.37,41.63 | 25.37,41.63 30.21,41.63 30.6,41.25 35.55,41.25 35.95,40.85 35.95,18 37.1,16.85 39.25,16.85 39.9,16.2 39.9,13.05 39.35,12.5 38.35,12.5 R11.2 | 38.15,12.5 R11.2 | R11.2 38.25,11.6 38.55,11.3 39.85,11.3 40.45,10.7 40.45,7.2 40.05,6.8 38.63,6.8 I2C.2 | 22.75,42.7 | 22.75,42.7 23.25,42.47 | v23.35,42.7 23.25,42.47 | 22.75,42.7 | 22.75,42.7 23.25,42.93 | v23.35,42.7 23.25,42.93 | 22.75,42.7 23.25,42.47 | 23.25,42.47 | v23.35,42.7 23.25,42.47 | 22.75,42.7 23.25,42.93 | v23.35,42.7 23.25,42.93 | 22.75,42.7 23.25,42.47 | v23.35,42.7 23.25,42.47 | 22.75,42.7 23.25,42.93 | v23.35,42.7 23.25,42.93 | 25.37,41.63 25.12,42.12 v24.9,42 | 25.37,41.63 24.84,41.76 v24.9,42
  Bottom 0.254: v23.35,42.7 23.95,42.7 | 23.95,42.7 24.2,42.7 24.48,42.42 | 24.48,42.42 v24.9,42 | 23.95,42.7 23.45,42.93 | v23.35,42.7 23.45,42.93 | 23.95,42.7 23.45,42.47 | v23.35,42.7 23.45,42.47 | 23.95,42.7 23.45,42.93 | 23.45,42.93 | v23.35,42.7 23.45,42.93 | 23.95,42.7 23.45,42.47 | v23.35,42.7 23.45,42.47 | 23.95,42.7 23.45,42.93 | v23.35,42.7 23.45,42.93 | 23.95,42.7 23.45,42.47 | v23.35,42.7 23.45,42.47 | 24.48,42.42 24.66,41.91 v24.9,42 | 24.48,42.42 24.99,42.23 v24.9,42
INP_1  (via drill 0.4)
  Top 0.254: STM32F103CB.41 18.7,36.8 19.3,37.4 20.1,37.4 20.3,37.6 20.35,38.34 R20.1 19.45,38.35 19,38.8 19,40.9 18.6,41.3 18.6,42.35 18.95,42.7 20.15,42.7 20.92,41.93 21.81,41.93 | v22.41,41.93 21.81,41.93 | 21.81,41.93 | 21.81,41.93 22.3,41.7 | v22.41,41.93 22.3,41.7 | 21.81,41.93 | 21.81,41.93 22.3,42.16 | v22.41,41.93 22.3,42.16 | 21.81,41.93 22.3,41.7 | 22.3,41.7 | v22.41,41.93 22.3,41.7 | 21.81,41.93 22.3,42.16 | v22.41,41.93 22.3,42.16 | 21.81,41.93 22.3,41.7 | v22.41,41.93 22.3,41.7 | 21.81,41.93 22.3,42.16 | v22.41,41.93 22.3,42.16
  Bottom 0.254: 27.26,49.9 PULS.4 28.6,50 28.8,49.8 | C19.2 36.45,49.8 36.25,50 PULS.3 29,50 28.8,49.8 | 28.8,49.8 28.8,48.4 28.65,48.25 28.65,46.55 28.49,46.38 28.49,41.16 27.97,40.64 23.7,40.64 22.83,41.51 | 22.83,41.51 v22.41,41.93 | 22.83,41.51 22.64,42.02 v22.41,41.93 | 22.83,41.51 22.32,41.7 v22.41,41.93
LED_GREEN
  Top 0.254: R14.2 14.5,47.95 13.15,46.6 13.15,43.55 14.25,42.45 15,42.45 15.2,42.25 15.2,39.9 15.65,39.45 15.65,36.55 16.2,36 STM32F103CB.46
LED_RED
  Top 0.254: R15.2 14.7,43.35 15.65,42.4 15.65,40.05 16.15,39.55 16.15,36.85 16.7,36.3 STM32F103CB.45
N$1
  Top 0.254: C1.1 12MHZ.3 11.1,31.7 11.55,31.25 STM32F103CB.5
N$2
  Top 0.254: R5.1 10.41,28.36 10.8,28.75 10.8,30.3 11.25,30.75 STM32F103CB.6
N$3
  Top 0.254: 12MHZ.1 6.85,29.4 7.06,29.19 C2.1 R5.2
N$4
  Top 0.254: STM32F103CB.44 17.2,38.34 R8.1
N$5
  Top 0.254: T2.B 12.15,5.15 12.5,5.5 R12.1
N$6
  Top 0.254: CONN.1 7.95,2.35 8.2,2.1 R2.1
N$7  (via drill 0.4)
  Top 0.254: v14.7,46.7 14.7,46.1 | 14.7,46.1 R15.1 | 14.7,46.1 14.93,46.59 | v14.7,46.7 14.93,46.59 | 14.7,46.1 14.47,46.59 | v14.7,46.7 14.47,46.59 | 14.7,46.1 14.93,46.59 | 14.93,46.59 | v14.7,46.7 14.93,46.59 | 14.7,46.1 14.47,46.59 | v14.7,46.7 14.47,46.59 | 14.7,46.1 14.93,46.59 | v14.7,46.7 14.93,46.59 | 14.7,46.1 14.47,46.59 | v14.7,46.7 14.47,46.59
  Bottom 0.254: R.A 15.6,47.6 15.12,47.12 | 15.12,47.12 v14.7,46.7 | 15.12,47.12 14.61,46.94 v14.7,46.7 | 15.12,47.12 14.94,46.61 v14.7,46.7
N$8  (via drill 0.4)
  Top 0.254: v14.7,51 14.7,50.4 | 14.7,50.4 R14.1 | 14.7,50.4 14.93,50.9 | v14.7,51 14.93,50.9 | 14.7,50.4 14.47,50.9 | v14.7,51 14.47,50.9 | 14.7,50.4 14.93,50.9 | 14.93,50.9 | v14.7,51 14.93,50.9 | 14.7,50.4 14.47,50.9 | v14.7,51 14.47,50.9 | 14.7,50.4 14.93,50.9 | v14.7,51 14.93,50.9 | 14.7,50.4 14.47,50.9 | v14.7,51 14.47,50.9
  Bottom 0.254: G.A 14.4,51.52 | 14.4,51.52 14.4,51.3 v14.7,51 | 14.4,51.52 14.45,50.98 v14.7,51 | 14.4,51.52 14.85,51.2 v14.7,51
N$9
  Top 0.254: R10.1 7.08,10.15 CONN.4
N$10
  Bottom 0.406: R18.2 ST.A
N$11
  Bottom 1.016: U$1.ANT U.FL.P$3
N$12
  Top 0.254: R16.2 30.7,13.95 30.95,13.7 30.95,10.45 31.4,10 31.4,9.55 31.2,9.35 USART.1
N$13
  Top 0.254: R21.2 30,10.9 29.75,10.65 28.3,10.65 27.8,10.15 27.8,7.2 28.15,6.85 29.67,6.85 USART.2
N$14
  Bottom 1.016: CONN.3 7.15,7.18 BAT60J.A
N$16
  Top 0.813: R6.2 4.24,49.48 BUZZER.+
N$17
  Top 0.254: FCM1608.2 7.16,21.65 C9.1 7.06,22.41 7.55,22.9 10.1,22.9 10.4,22.6 10.4,21.76 C8.1 10.25,21.75 10.41,21.91 10.41,22.61 10.7,22.9 11.05,22.9 11.3,23.15 11.3,25.6 11.7,26 11.7,28.65 12.3,29.25 STM32F103CB.9
N$21
  Top 0.254: R4.1 T1.B
N$23
  Top 0.813: T1.C 11.75,49.4 BUZZER.-
N$25  (via drill 0.4)
  Top 0.254: v33.23,43.2 32.87,43.2 32.67,43.4 | 32.67,43.4 31.81,44.26 29.17,44.26 28.03,43.11 27.95,43.11 | 27.95,43.11 27.53,43.11 v27.37,43.27 | 32.67,43.4 33.05,43.02 v33.23,43.2 | 32.67,43.4 33.21,43.45 v33.23,43.2 | 27.95,43.11 27.53,43.46 v27.37,43.27 | 27.95,43.11 27.41,43.02 v27.37,43.27
  Bottom 0.254: U$1.GPIO_1 33.5,43.74 | 33.5,43.74 33.5,43.47 v33.23,43.2 | v27.37,43.27 27.37,43.87 | 27.37,43.87 27.37,44.72 U$1.RXON | 33.5,43.74 33.07,43.4 v33.23,43.2 | 33.5,43.74 33.48,43.19 v33.23,43.2 | 27.37,43.87 | 27.37,43.87 27.14,43.38 | v27.37,43.27 27.14,43.38 | 27.37,43.87 | 27.37,43.87 27.6,43.38 | v27.37,43.27 27.6,43.38 | 27.37,43.87 27.14,43.38 | 27.14,43.38 | v27.37,43.27 27.14,43.38 | 27.37,43.87 27.6,43.38 | v27.37,43.27 27.6,43.38 | 27.37,43.87 27.14,43.38 | v27.37,43.27 27.14,43.38 | 27.37,43.87 27.6,43.38 | v27.37,43.27 27.6,43.38
N$26  (via drill 0.4)
  Top 0.254: v26.05,42.85 26.47,42.43 | 26.47,42.43 26.84,42.06 30.33,42.06 30.85,42.6 31.08,42.83 | 31.08,42.83 v31.5,43.25 | 26.47,42.43 26.29,42.94 v26.05,42.85 | 26.47,42.43 25.96,42.62 v26.05,42.85 | 31.08,42.83 31.59,43.02 v31.5,43.25 | 31.08,42.83 31.27,43.34 v31.5,43.25
  Bottom 0.254: U$1.TXON 25.5,43.4 25.63,43.27 | 25.63,43.27 v26.05,42.85 | v31.5,43.25 31.5,43.85 | 31.5,43.85 U$1.GPIO_0 | 25.63,43.27 25.82,42.76 v26.05,42.85 | 25.63,43.27 26.14,43.09 v26.05,42.85 | 31.5,43.85 | 31.5,43.85 31.27,43.35 | v31.5,43.25 31.27,43.35 | 31.5,43.85 | 31.5,43.85 31.73,43.35 | v31.5,43.25 31.73,43.35 | 31.5,43.85 31.27,43.35 | 31.27,43.35 | v31.5,43.25 31.27,43.35 | 31.5,43.85 31.73,43.35 | v31.5,43.25 31.73,43.35 | 31.5,43.85 31.27,43.35 | v31.5,43.25 31.27,43.35 | 31.5,43.85 31.73,43.35 | v31.5,43.25 31.73,43.35
NRF_CE  (via drill 0.4)
  Top 0.254: v18.65,23.4 18.65,24 | 18.65,24 18.65,24.4 18.2,24.85 STM32F103CB.19 | 18.65,24 | 18.65,24 18.42,23.5 | v18.65,23.4 18.42,23.5 | 18.65,24 | 18.65,24 18.88,23.5 | v18.65,23.4 18.88,23.5 | 18.65,24 18.42,23.5 | 18.42,23.5 | v18.65,23.4 18.42,23.5 | 18.65,24 18.88,23.5 | v18.65,23.4 18.88,23.5 | 18.65,24 18.42,23.5 | v18.65,23.4 18.42,23.5 | 18.65,24 18.88,23.5 | v18.65,23.4 18.88,23.5
  Bottom 0.254: NRF24L01_SMD.P$7 13.78,16.4 14,16.63 14,18.75 18.23,22.98 | 18.23,22.98 v18.65,23.4 | 18.23,22.98 18.74,23.16 v18.65,23.4 | 18.23,22.98 18.41,23.49 v18.65,23.4
NRF_CSN  (via drill 0.4)
  Top 0.254: v14.1,20.2 14.3,20.38 14.3,20.77 | 14.3,20.77 14.3,23.57 15.7,24.95 STM32F103CB.14 | 14.3,20.77 13.92,20.38 v14.1,20.2 | 14.3,20.77 14.35,20.22 v14.1,20.2
  Bottom 0.254: NRF24L01_SMD.P$6 12.5,16.43 12.63,16.56 12.63,18.71 13.68,19.77 | 13.68,19.77 v14.1,20.2 | 13.68,19.77 13.86,20.29 | v14.1,20.2 13.86,20.29 | 13.68,19.77 14.19,19.97 v14.1,20.2 | 13.68,19.77 13.86,20.29 | v14.1,20.2 13.86,20.29
NRF_IRQ  (via drill 0.4)
  Top 0.254: v19.4,36.25 19.7,35.9 19.7,35.73 | 19.7,35.73 STM32F103CB.39 | 19.7,35.73 19.65,36.27 v19.4,36.25 | 19.7,35.73 19.25,36.05 v19.4,36.25
  Bottom 0.254: NRF24L01_SMD.P$2 7.43,16.73 8.6,17.9 8.6,20.35 13.25,25 13.25,27 14.75,28.5 14.75,35.6 15.35,36.25 18.8,36.25 | 18.8,36.25 v19.4,36.25 | 18.8,36.25 | 18.8,36.25 19.3,36.02 | v19.4,36.25 19.3,36.02 | 18.8,36.25 | 18.8,36.25 19.3,36.48 | v19.4,36.25 19.3,36.48 | 18.8,36.25 19.3,36.02 | 19.3,36.02 | v19.4,36.25 19.3,36.02 | 18.8,36.25 19.3,36.48 | v19.4,36.25 19.3,36.48 | 18.8,36.25 19.3,36.02 | v19.4,36.25 19.3,36.02 | 18.8,36.25 19.3,36.48 | v19.4,36.25 19.3,36.48
NSRST
  Top 0.254: R9.2 C5.1 8.71,25.36 9.05,25.7 10.75,25.7 11.25,26.2 11.25,29.7 11.8,30.25 STM32F103CB.7
PPM
  Top 0.254: CONN.5 6.49,12.51 6.2,12.8 R3.2
SPI1_MISO  (via drill 0.4)
  Top 0.254: v16.25,23.35 16.67,23.77 | 16.67,23.77 16.7,23.8 STM32F103CB.16 | 16.67,23.77 16.16,23.59 v16.25,23.35 | 16.67,23.77 16.48,23.26 v16.25,23.35
  Bottom 0.254: NRF24L01_SMD.P$3 8.7,17.4 14.5,23.2 15.67,23.2 | 15.67,23.2 16.1,23.2 v16.25,23.35 | 15.67,23.2 16.2,23.1 v16.25,23.35 | 15.67,23.2 16.09,23.54 v16.25,23.35
SPI1_MOSI  (via drill 0.4)
  Top 0.254: v17.2,23.05 17.2,23.65 | 17.2,23.65 STM32F103CB.17 | 17.2,23.65 | 17.2,23.65 16.97,23.16 | v17.2,23.05 16.97,23.16 | 17.2,23.65 | 17.2,23.65 17.43,23.16 | v17.2,23.05 17.43,23.16 | 17.2,23.65 16.97,23.16 | 16.97,23.16 | v17.2,23.05 16.97,23.16 | 17.2,23.65 17.43,23.16 | v17.2,23.05 17.43,23.16 | 17.2,23.65 16.97,23.16 | v17.2,23.05 16.97,23.16 | 17.2,23.65 17.43,23.16 | v17.2,23.05 17.43,23.16
  Bottom 0.254: NRF24L01_SMD.P$4 9.97,17.82 14.65,22.5 16.65,22.5 16.78,22.63 | 16.78,22.63 v17.2,23.05 | 16.78,22.63 17.29,22.82 v17.2,23.05 | 16.78,22.63 16.96,23.14 v17.2,23.05
SPI1_SCK  (via drill 0.4)
  Top 0.254: v15.15,21.7 15.3,21.7 15.5,21.9 15.5,22.19 | 15.5,22.19 15.5,24.15 16.2,24.85 STM32F103CB.15 | 15.5,22.19 15.03,21.92 v15.15,21.7 | 15.5,22.19 15.4,21.65 v15.15,21.7
  Bottom 0.254: NRF24L01_SMD.P$5 11.25,16.43 11.31,16.49 11.31,18.44 14.55,21.7 | 14.55,21.7 v15.15,21.7 | 14.55,21.7 | 14.55,21.7 15.04,21.47 | v15.15,21.7 15.04,21.47 | 14.55,21.7 | 14.55,21.7 15.04,21.93 | v15.15,21.7 15.04,21.93 | 14.55,21.7 15.04,21.47 | 15.04,21.47 | v15.15,21.7 15.04,21.47 | 14.55,21.7 15.04,21.93 | v15.15,21.7 15.04,21.93 | 14.55,21.7 15.04,21.47 | v15.15,21.7 15.04,21.47 | 14.55,21.7 15.04,21.93 | v15.15,21.7 15.04,21.93
SPI2_MISO  (via drill 0.4)
  Top 0.254: STM32F103CB.27 23.5,28.75 24.05,28.2 24.05,22.25 25.8,20.5 25.8,15.5 26.25,15.05 27.45,15.05 28.1,15.7 29.65,15.7 29.85,15.55 30.4,15.55 30.9,15.05 30.9,14.4 31.65,13.6 | 31.65,13.6 v32.25,13.6 | 31.65,13.6 | 31.65,13.6 32.15,13.37 | v32.25,13.6 32.15,13.37 | 31.65,13.6 | 31.65,13.6 32.15,13.83 | v32.25,13.6 32.15,13.83 | 31.65,13.6 32.15,13.37 | 32.15,13.37 | v32.25,13.6 32.15,13.37 | 31.65,13.6 32.15,13.83 | v32.25,13.6 32.15,13.83 | 31.65,13.6 32.15,13.37 | v32.25,13.6 32.15,13.37 | 31.65,13.6 32.15,13.83 | v32.25,13.6 32.15,13.83
  Bottom 0.254: v32.25,13.6 32.85,13.6 | 32.85,13.6 33.2,13.6 33.5,13.3 U$1.SDO | 32.85,13.6 32.35,13.83 | v32.25,13.6 32.35,13.83 | 32.85,13.6 32.35,13.37 | v32.25,13.6 32.35,13.37 | 32.85,13.6 32.35,13.83 | 32.35,13.83 | v32.25,13.6 32.35,13.83 | 32.85,13.6 32.35,13.37 | v32.25,13.6 32.35,13.37 | 32.85,13.6 32.35,13.83 | v32.25,13.6 32.35,13.83 | 32.85,13.6 32.35,13.37 | v32.25,13.6 32.35,13.37
SPI2_MOSI  (via drill 0.4)
  Top 0.254: STM32F103CB.28 23.9,29.25 24.5,28.65 24.5,22.5 26.25,20.75 26.25,15.85 26.6,15.5 27.25,15.5 27.9,16.15 30.8,16.15 30.83,16.12 | 30.83,16.12 v31.25,15.7 | 30.83,16.12 31.02,15.61 v31.25,15.7 | 30.83,16.12 31.34,15.94 v31.25,15.7
  Bottom 0.254: v31.25,15.7 31.25,15.1 | 31.25,15.1 31.25,13.6 31.5,13.35 U$1.SDI | 31.25,15.1 31.48,15.6 | v31.25,15.7 31.48,15.6 | 31.25,15.1 31.02,15.6 | v31.25,15.7 31.02,15.6 | 31.25,15.1 31.48,15.6 | 31.48,15.6 | v31.25,15.7 31.48,15.6 | 31.25,15.1 31.02,15.6 | v31.25,15.7 31.02,15.6 | 31.25,15.1 31.48,15.6 | v31.25,15.7 31.48,15.6 | 31.25,15.1 31.02,15.6 | v31.25,15.7 31.02,15.6
SPI2_SCK  (via drill 0.4)
  Top 0.254: STM32F103CB.26 23.1,28.25 23.6,27.75 23.6,22 25.35,20.25 25.35,15.25 26,14.6 27.6,14.6 28.05,15.05 28.5,15.05 | 28.5,15.05 29.05,15.05 v29.1,15 | 28.5,15.05 28.98,14.78 v29.1,15 | 28.5,15.05 29.02,15.24 v29.1,15
  Bottom 0.254: v29.1,15 29.1,14.4 | 29.1,14.4 29.1,13.6 29.5,13.2 U$1.SCK | 29.1,14.4 29.33,14.89 | v29.1,15 29.33,14.89 | 29.1,14.4 28.87,14.89 | v29.1,15 28.87,14.89 | 29.1,14.4 29.33,14.89 | 29.33,14.89 | v29.1,15 29.33,14.89 | 29.1,14.4 28.87,14.89 | v29.1,15 28.87,14.89 | 29.1,14.4 29.33,14.89 | v29.1,15 29.33,14.89 | 29.1,14.4 28.87,14.89 | v29.1,15 28.87,14.89
SWCLK  (via drill 0.4)
  Top 0.254: STM32F103CB.37 20.7,35.6 20.8,35.7 21.02,35.7 21.27,35.45 21.27,34.58 21.85,34.05 22.01,34.05 | 22.01,34.05 22.5,34.05 v22.6,33.95 | v31.8,18.9 31.8,18.3 | 31.8,18.3 31.8,16.9 32.2,16.5 D2.C 32.75,14.45 33.1,14.1 33.1,13.4 32.8,13.1 32.8,10.4 32.3,9.9 32.3,4.65 32.65,4.3 34.18,4.3 SWD.2 | 22.01,34.05 22.46,33.74 v22.6,33.95 | 22.01,34.05 22.54,34.19 v22.6,33.95 | 31.8,18.3 32.03,18.8 | v31.8,18.9 32.03,18.8 | 31.8,18.3 31.57,18.8 | v31.8,18.9 31.57,18.8 | 31.8,18.3 32.03,18.8 | 32.03,18.8 | v31.8,18.9 32.03,18.8 | 31.8,18.3 31.57,18.8 | v31.8,18.9 31.57,18.8 | 31.8,18.3 32.03,18.8 | v31.8,18.9 32.03,18.8 | 31.8,18.3 31.57,18.8 | v31.8,18.9 31.57,18.8
  Bottom 0.254: v22.6,33.95 22.95,33.6 22.95,33.46 | 22.95,33.46 22.95,28.1 22.55,27.7 22.55,26.8 25.2,24.15 25.2,23.15 29.35,19.05 31.22,19.05 | 31.22,19.05 31.65,19.05 v31.8,18.9 | 22.95,33.46 22.85,34 v22.6,33.95 | 22.95,33.46 22.48,33.73 v22.6,33.95 | 31.22,19.05 31.64,18.71 v31.8,18.9 | 31.22,19.05 31.75,19.15 v31.8,18.9
SWDIO  (via drill 0.4)
  Top 0.254: STM32F103CB.34 23.45,32.25 23.65,32.05 23.65,31.05 | 23.65,31.05 v23.65,30.45 | 34.45,11.85 D1.C | SWD.4 34.15,10.45 34.4,10.7 D1.C | v32.95,19.1 32.95,18.5 | 32.95,18.5 32.95,15.65 33.4,15.2 33.4,14.4 34.4,13.4 D1.C | 23.65,31.05 | 23.65,31.05 23.42,30.55 | v23.65,30.45 23.42,30.55 | 23.65,31.05 | 23.65,31.05 23.88,30.55 | v23.65,30.45 23.88,30.55 | 23.65,31.05 23.42,30.55 | 23.42,30.55 | v23.65,30.45 23.42,30.55 | 23.65,31.05 23.88,30.55 | v23.65,30.45 23.88,30.55 | 23.65,31.05 23.42,30.55 | v23.65,30.45 23.42,30.55 | 23.65,31.05 23.88,30.55 | v23.65,30.45 23.88,30.55 | 32.95,18.5 33.18,19 | v32.95,19.1 33.18,19 | 32.95,18.5 32.72,19 | v32.95,19.1 32.72,19 | 32.95,18.5 33.18,19 | 33.18,19 | v32.95,19.1 33.18,19 | 32.95,18.5 32.72,19 | v32.95,19.1 32.72,19 | 32.95,18.5 33.18,19 | v32.95,19.1 33.18,19 | 32.95,18.5 32.72,19 | v32.95,19.1 32.72,19
  Bottom 0.254: v23.65,30.45 23.65,29.85 | 23.65,29.85 23.65,28.1 23.2,27.65 23.2,26.85 25.65,24.4 25.65,23.4 29.45,19.65 32.4,19.65 32.53,19.52 | 32.53,19.52 v32.95,19.1 | 23.65,29.85 23.88,30.34 | v23.65,30.45 23.88,30.34 | 23.65,29.85 23.42,30.34 | v23.65,30.45 23.42,30.34 | 23.65,29.85 23.88,30.34 | 23.88,30.34 | v23.65,30.45 23.88,30.34 | 23.65,29.85 23.42,30.34 | v23.65,30.45 23.42,30.34 | 23.65,29.85 23.88,30.34 | v23.65,30.45 23.88,30.34 | 23.65,29.85 23.42,30.34 | v23.65,30.45 23.42,30.34 | 32.53,19.52 32.72,19.01 v32.95,19.1 | 32.53,19.52 33.04,19.34 v32.95,19.1
TIM2_CH2_BUZZER  (via drill 0.4)
  Top 0.254: v9.25,41.7 9.25,42.3 | 9.25,42.3 R4.2 | v12.4,28.4 12.55,28.25 12.98,28.25 | 12.98,28.25 STM32F103CB.11 | 12.98,28.25 12.56,28.59 v12.4,28.4 | 12.98,28.25 12.45,28.15 v12.4,28.4 | 9.25,42.3 | 9.25,42.3 9.02,41.8 | v9.25,41.7 9.02,41.8 | 9.25,42.3 | 9.25,42.3 9.48,41.8 | v9.25,41.7 9.48,41.8 | 9.25,42.3 9.02,41.8 | 9.02,41.8 | v9.25,41.7 9.02,41.8 | 9.25,42.3 9.48,41.8 | v9.25,41.7 9.48,41.8 | 9.25,42.3 9.02,41.8 | v9.25,41.7 9.02,41.8 | 9.25,42.3 9.48,41.8 | v9.25,41.7 9.48,41.8
  Bottom 0.254: v12.4,28.4 12.4,29 | 12.4,29 12.4,31.75 11.75,32.4 10.9,32.4 10.35,32.95 10.35,34.6 9.25,35.7 9.25,41.1 | 9.25,41.1 v9.25,41.7 | 12.4,29 | 12.4,29 12.17,28.5 | v12.4,28.4 12.17,28.5 | 12.4,29 | 12.4,29 12.63,28.5 | v12.4,28.4 12.63,28.5 | 12.4,29 12.17,28.5 | 12.17,28.5 | v12.4,28.4 12.17,28.5 | 12.4,29 12.63,28.5 | v12.4,28.4 12.63,28.5 | 12.4,29 12.17,28.5 | v12.4,28.4 12.17,28.5 | 12.4,29 12.63,28.5 | v12.4,28.4 12.63,28.5 | 9.25,41.1 9.48,41.59 | v9.25,41.7 9.48,41.59 | 9.25,41.1 9.02,41.59 | v9.25,41.7 9.02,41.59 | 9.25,41.1 9.48,41.59 | 9.48,41.59 | v9.25,41.7 9.48,41.59 | 9.25,41.1 9.02,41.59 | v9.25,41.7 9.02,41.59 | 9.25,41.1 9.48,41.59 | v9.25,41.7 9.48,41.59 | 9.25,41.1 9.02,41.59 | v9.25,41.7 9.02,41.59
TIM3_CH1
  Top 0.254: R3.1 7.9,17.8 8.3,18.2 8.3,19.95 9,20.65 10.95,20.65 11.9,21.6 11.9,25.05 15.2,28.35 15.2,32.65 15.8,33.25 18.8,33.25 19.2,33.65 STM32F103CB.40
USART1_RX  (via drill 0.4)
  Top 0.254: STM32F103CB.31 21.3,30.75 20.55,30 20.55,28.65 20.1,28.2 15.65,28.2 12.35,24.9 12.35,21.45 11.05,20.15 9.2,20.15 8.9,19.85 8.9,13.9 8.72,13.72 | R17.2 10.9,3.35 10.5,3.75 9.2,3.75 R2.2 9.15,4.75 8.45,5.45 T2.C 8.45,6.9 8.95,7.4 8.95,8.4 | 8.72,13.72 v8.3,13.3 | v8.95,9 8.95,8.4 | 8.72,13.72 8.21,13.54 v8.3,13.3 | 8.72,13.72 8.54,13.21 v8.3,13.3 | 8.95,8.4 9.18,8.89 v8.95,9 | 8.95,8.4 8.72,8.89 v8.95,9
  Bottom 0.254: v8.3,13.3 8.3,12.7 | 8.3,12.7 8.3,9.65 8.53,9.42 | 8.53,9.42 v8.95,9 | 8.3,12.7 8.53,13.2 v8.3,13.3 | 8.3,12.7 8.07,13.2 v8.3,13.3 | 8.53,9.42 8.71,8.91 v8.95,9 | 8.53,9.42 9.04,9.23 v8.95,9
USART1_TX
  Top 0.254: STM32F103CB.30 21.45,30.25 21.05,29.85 21.05,28.15 20.65,27.75 15.8,27.75 12.85,24.8 12.85,21.15 11.4,19.7 9.6,19.7 9.35,19.45 9.35,13.1 9,12.75 9,11.95 R10.2
USART2_TX  (via drill 0.4)
  Top 0.254: v12.5,27.3 12.92,27.72 | 12.92,27.72 12.95,27.75 STM32F103CB.12 | R12.2 12.55,7.9 12.55,8.4 | 12.55,8.4 12.55,8.97 v12.53,9 | 12.55,8.4 12.76,8.9 v12.53,9 | 12.55,8.4 12.3,8.89 v12.53,9 | 12.92,27.72 12.41,27.54 v12.5,27.3 | 12.92,27.72 12.73,27.21 v12.5,27.3
  Bottom 0.254: 12.5,26.7 12.5,26.35 11.62,25.48 11.62,24.12 10.68,23.2 8.43,23.2 7.33,22.1 7.33,20.15 4.95,17.77 4.95,14.62 5.5,14.07 9.3,14.07 12.28,11.1 12.28,10.38 12.5,10.15 12.5,9.6 | 12.5,26.7 v12.5,27.3 | 12.5,9.6 12.5,9.03 v12.53,9 | 12.5,9.6 12.29,9.1 v12.53,9 | 12.5,9.6 12.75,9.11 v12.53,9 | 12.5,26.7 12.73,27.2 | v12.5,27.3 12.73,27.2 | 12.5,26.7 12.27,27.2 | v12.5,27.3 12.27,27.2 | 12.5,26.7 12.73,27.2 | 12.73,27.2 | v12.5,27.3 12.73,27.2 | 12.5,26.7 12.27,27.2 | v12.5,27.3 12.27,27.2 | 12.5,26.7 12.73,27.2 | v12.5,27.3 12.73,27.2 | 12.5,26.7 12.27,27.2 | v12.5,27.3 12.27,27.2
USART3_RX
  Top 0.254: STM32F103CB.22 19.7,25.5 20.35,24.85 20.35,23.48 21.02,22.8 21.85,22.8 22.25,22.4 22.25,21.3 22.4,21.15 23.8,21.15 24.9,20.05 24.9,14.9 25.7,14.1 27.7,14.1 27.85,13.95 R16.1
USART3_TX
  Top 0.254: STM32F103CB.21 19.2,25.25 19.85,24.6 19.85,23.35 20.85,22.35 21.6,22.35 21.8,22.15 21.8,20.9 22.05,20.65 23.55,20.65 24.45,19.75 24.45,12.7 25.3,11.9 R21.1
VBAT_S
  Top 0.254: R13.1 24.6,8.8 24.5,8.9 R1.1 24.5,10.93 24,11.45 24,19.55 23.35,20.2 18.15,20.2 17.95,20.4 17.95,23.55 17.7,23.8 STM32F103CB.18
VCC  (via drill 0.4, 0.8)
  Top 0.254: C4.2 14.95,39.05 15.2,38.8 STM32F103CB.48 | STM32F103CB.1 12.8,33.25 12.75,33.3 12.75,36.21 C12.1 | STM32F103CB.36 23.15,33.25 23.5,33.6 23.5,37.2 23,37.7 C18.1 | I2C.3 37.22,4.28 36.75,4.75 36.75,11.25 36.55,11.45 R11.1 R7.1 | 21,25.2 C17.1 | STM32F103CB.24 20.7,25.5 21,25.2 | 21,25.2 21,24.97 | 21,24.97 21,24.6 v21.2,24.4 | v20.6,19.2 20.6,18.6 | 20.6,18.6 20.6,17.77 C6.1 | 21,24.97 20.95,24.42 v21.2,24.4 | 21,24.97 21.38,24.57 v21.2,24.4 | 20.6,18.6 20.83,19.09 | v20.6,19.2 20.83,19.09 | 20.6,18.6 20.37,19.09 | v20.6,19.2 20.37,19.09 | 20.6,18.6 20.83,19.09 | 20.83,19.09 | v20.6,19.2 20.83,19.09 | 20.6,18.6 20.37,19.09 | v20.6,19.2 20.37,19.09 | 20.6,18.6 20.83,19.09 | v20.6,19.2 20.83,19.09 | 20.6,18.6 20.37,19.09 | v20.6,19.2 20.37,19.09
  Top 0.406: v15.45,0.8 15.45,1.4 | 15.45,1.4 15.45,2.75 | 15.7,3 15.45,2.75 | 15.45,2.75 15.2,3 15.6,3.3 | SWD.1 34.15,2.45 34.65,2.95 38.1,2.95 38.6,3.45 I2C.3 | 15.45,1.4 15.28,0.85 | v15.45,0.8 15.28,0.85 | 15.45,1.4 15.62,0.85 | v15.45,0.8 15.62,0.85 | 15.45,1.4 15.28,0.85 | 15.45,1.4 15.62,0.85 | 15.45,1.4 15.28,0.85 | v15.45,0.8 15.28,0.85 | 15.45,1.4 15.62,0.85 | v15.45,0.8 15.62,0.85
  Top 0.813: REG1117.2 16.76,7.41 16.45,7.15 14.7,7.15 14.45,6.9 C15.1 | C15.1 15.6,3.3 16.55,3.3 C7.1 | C15.1 13.75,3.3 13.35,2.9 13.35,2.38 12.75,1.6 11.75,1.6 R17.1 | 4.35,19.25 4,18.9 4,16.8 3.55,16.35 1.35,16.35 0.9,15.9 0.9,1.25 1.35,0.8 11.5,0.8 11.7,1 R17.1 | 11.6,1.55 R17.1 | 11.65,1.6 R17.1 | FCM1608.1 4.35,19.25 | 4.35,19.25 4,19.6 4,24.2 4.15,24.2 4.15,24.35 | 4.15,24.35 4.15,24.6 4,24.75 4,40 | 4,40 4,44.05 4.2,44.3 4.2,45.22 R6.1 | R9.1 4.17,24.38 4.15,24.35 | 12.05,40.6 12.71,39.94 C4.2 C12.1 | 12.05,40.6 4.65,40.6 4.1,41.1 4.45,40.45 4,40 | C18.1 22.46,39.49 21.9,40.05 R20.2 20.34,41.02 v19.65,41.7 | v12.8,41.25 12.7,41.25 12.05,40.6
  Top 1.422: REG1117.2 v16.76,11.1 16.76,15.12 REG1117.4
  Bottom 0.254: v21.2,24.4 21.2,23.8 | 21.2,23.8 21.2,19.8 21.02,19.62 | 21.02,19.62 v20.6,19.2 | 21.2,23.8 21.43,24.3 | v21.2,24.4 21.43,24.3 | 21.2,23.8 20.97,24.3 | v21.2,24.4 20.97,24.3 | 21.2,23.8 21.43,24.3 | 21.43,24.3 | v21.2,24.4 21.43,24.3 | 21.2,23.8 20.97,24.3 | v21.2,24.4 20.97,24.3 | 21.2,23.8 21.43,24.3 | v21.2,24.4 21.43,24.3 | 21.2,23.8 20.97,24.3 | v21.2,24.4 20.97,24.3 | 21.02,19.62 20.51,19.43 v20.6,19.2 | 21.02,19.62 20.84,19.11 v20.6,19.2
  Bottom 0.406: SWD.1 34.15,0.95 33.8,0.6 16.02,0.6 | 16.02,0.6 15.65,0.6 v15.45,0.8 | 16.02,0.6 15.55,0.94 v15.45,0.8 | 16.02,0.6 15.44,0.63 v15.45,0.8
  Bottom 0.813: v19.65,41.7 13.25,41.7 v12.8,41.25 | v16.76,11.1 16.75,11.36 16.75,14.04 16.76,14.05 | NRF24L01_SMD.P$8 15.05,14.45 15.35,14.15 16.66,14.15 16.76,14.05 | C6.1 18.04,14.63 17.65,14.25 16.76,14.25 16.76,14.05 | 16.76,14 16.76,14.05
  pour Top: 23.75,10.6 9.7,10.6 9.7,19.7 23.75,19.7
VI
  Top 0.254: R13.2 C20.1 26.8,4.9 27.45,4.25 29.73,4.25
  Top 0.406: 29.73,4.25 USART.3
  Bottom 0.813: 12.98,5.83 12.98,5.9
  Bottom 1.016: BAT60J.C 11.97,7.18 12.1,7.05 12.69,6.29 | 12.69,6.29 12.98,5.9 TSR-1-2450.1 16.71,4.89 17.35,4.25 29.73,4.25 USART.3 | C10.1 11.7,5.3 12.69,6.29

### Text on the board
bPlace: PPM | CMD | AriloTX | V+ | GND | TEL | (c) J.ARIGITA